# Altium schematic sheet all_Masterboard_EE.SchDoc
size D
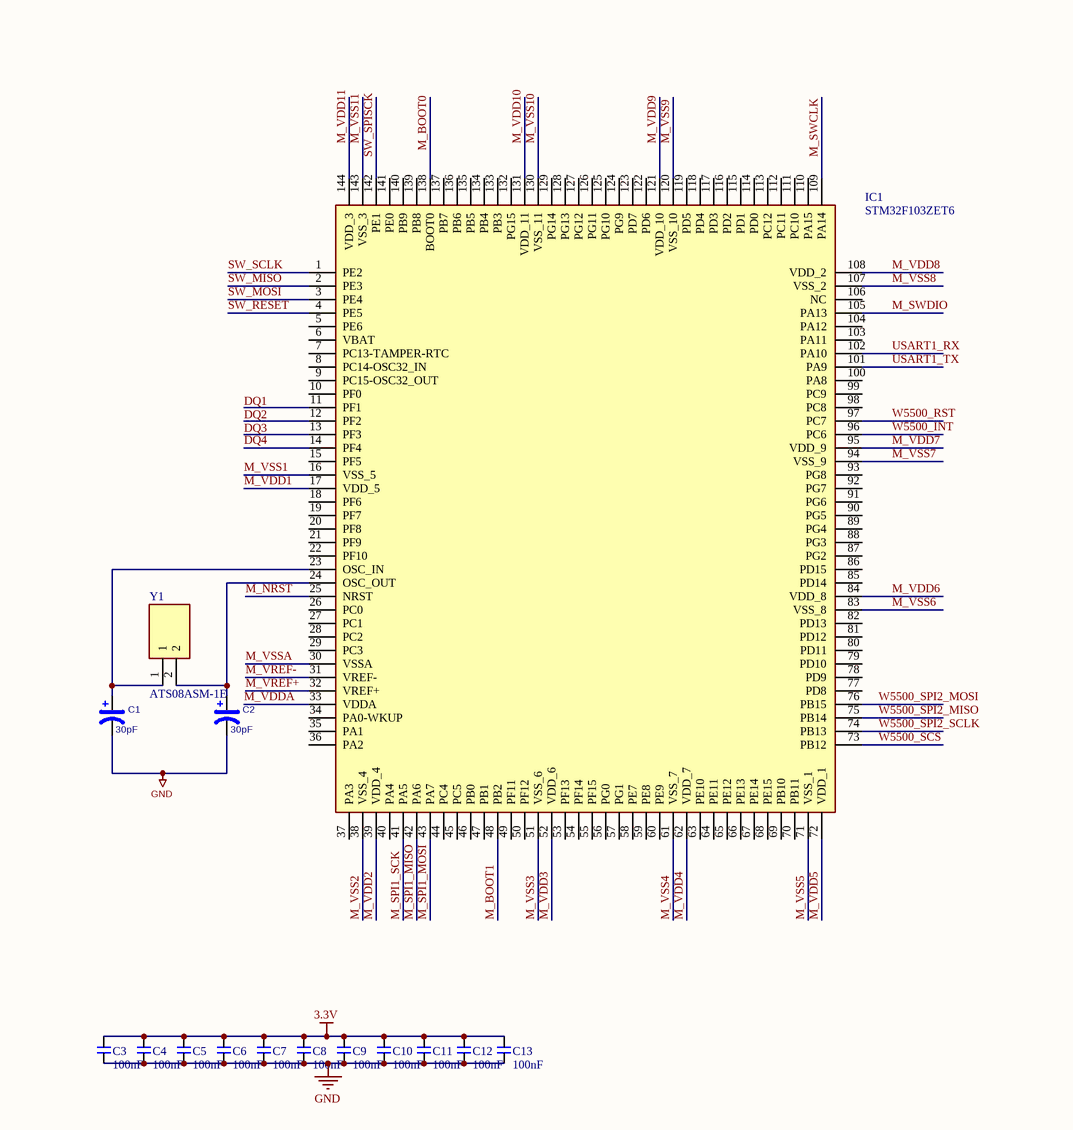
[diagram p0: all_Masterboard_EE.SchDoc, top left]
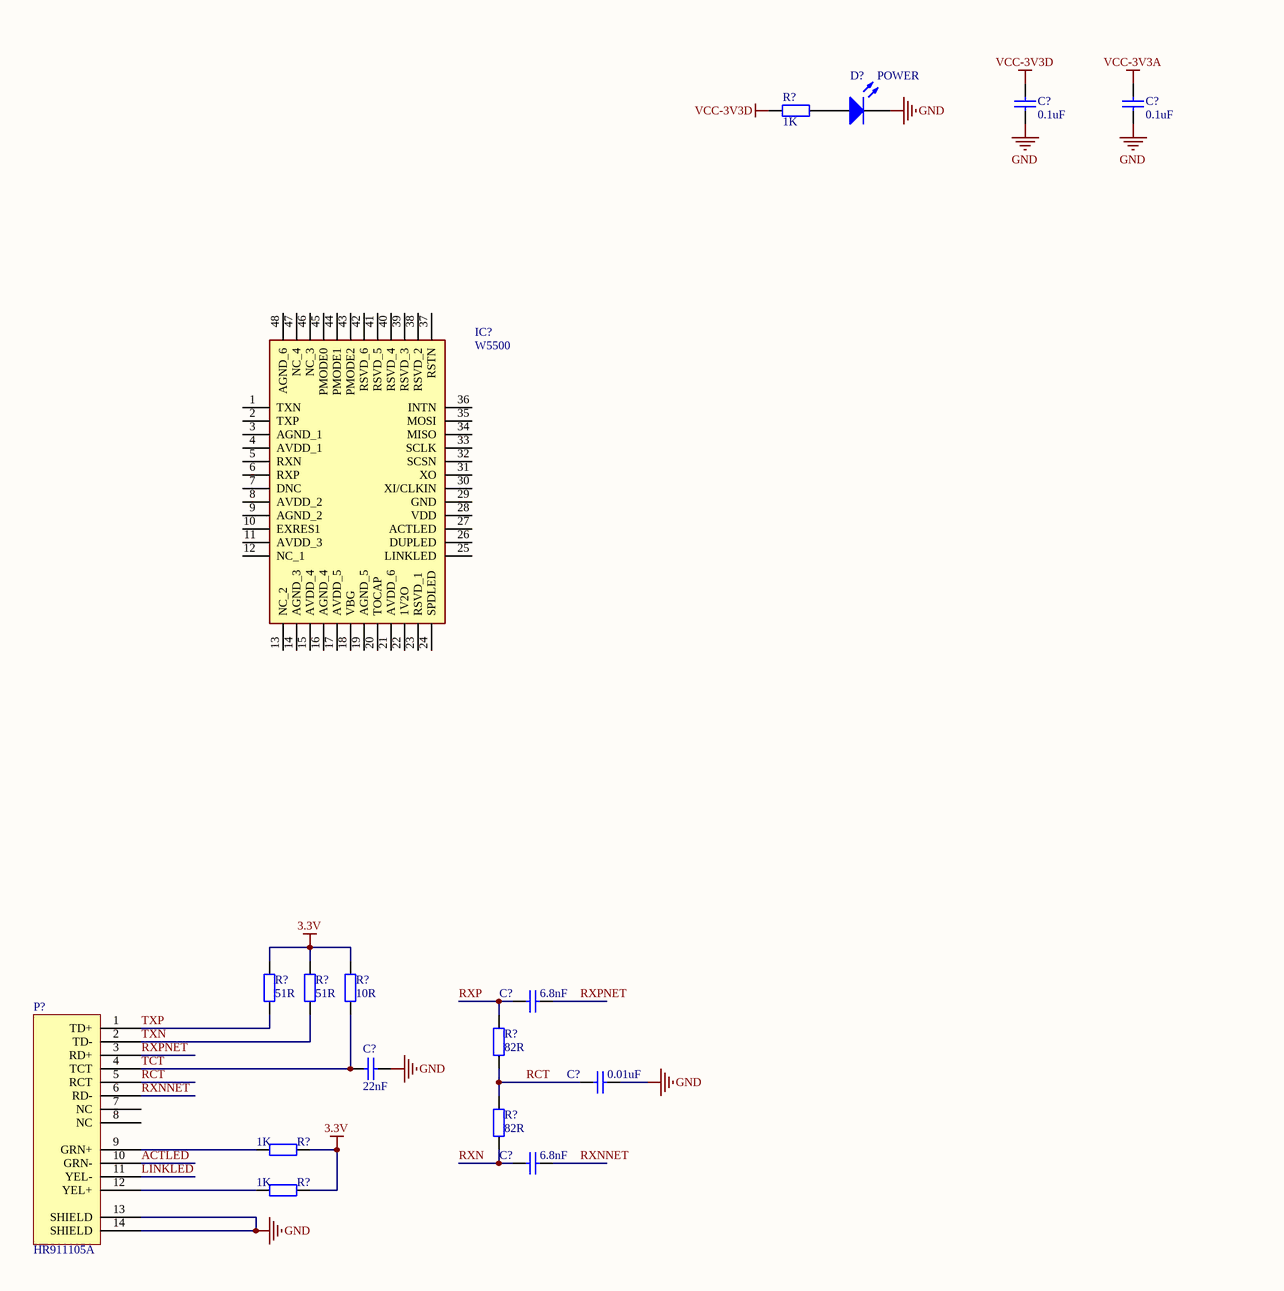
[diagram p1: all_Masterboard_EE.SchDoc, top right]
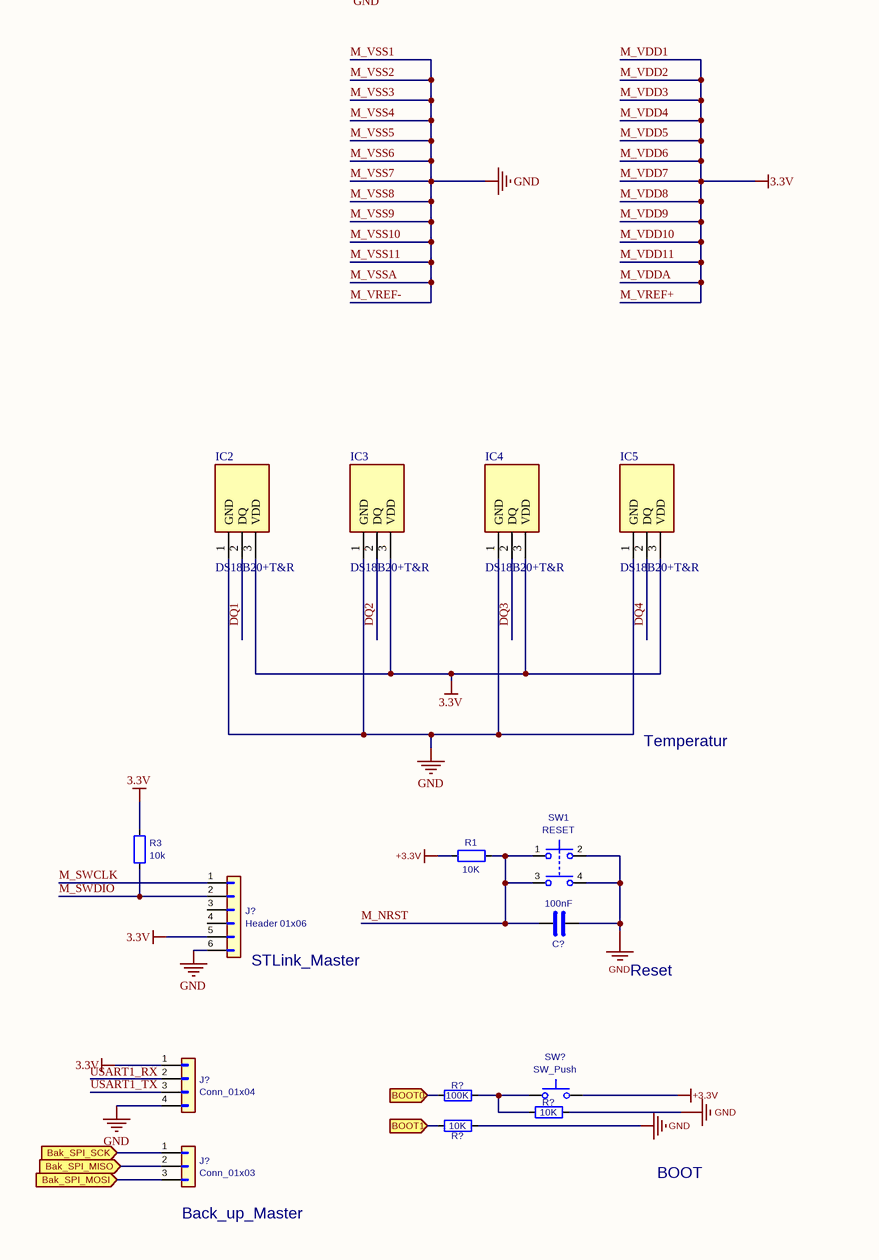
[diagram p2: all_Masterboard_EE.SchDoc, bottom left]
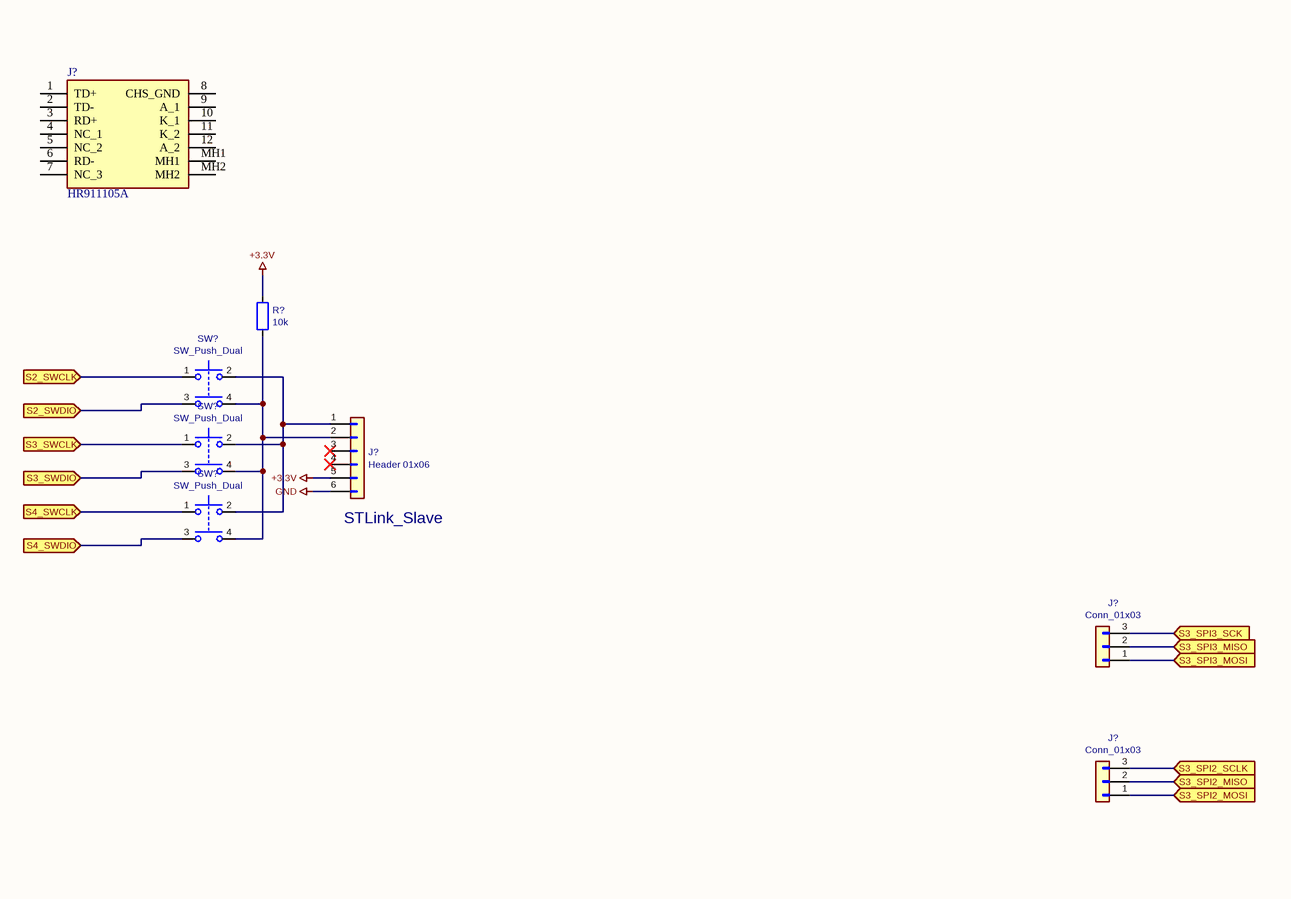
[diagram p3: all_Masterboard_EE.SchDoc, bottom right]

## Parts
(Parts that share a designator on the sheet are numbered #1, #2 ... from top to bottom, then left to right.)
C1  30pF  [0603]
C2  30pF  [0603]
C3  100nF  [0603]
C4  100nF  [0603]
C5  100nF  [0603]
C6  100nF  [0603]
C7  100nF  [0603]
C8  100nF  [0603]
C9  100nF  [0603]
C10  100nF  [0603]
C11  100nF  [0603]
C12  100nF  [0603]
C13  100nF  [0603]
C?#1  value 0.1uF  [C0805]  (hidden comment: Cap)
C?#2  value 0.1uF  [C0805]  (hidden comment: Cap)
C?#3  value 6.8nF  [C0805]  (hidden comment: Cap)
C?#4  value 22nF  [C0805]  (hidden comment: Cap)
C?#5  value 0.01uF  [C0805]  (hidden comment: Cap)
C?#6  value 6.8nF  [C0805]  (hidden comment: Cap)
C?#7  value 100nF  (hidden comment: 104)
D?  POWER  [C0805]
IC1  STM32F103ZET6  [QFP50P2200X2200X160-144N]
IC2  DS18B20+T&R  [DS18B20TR]
IC3  DS18B20+T&R  [DS18B20TR]
IC4  DS18B20+T&R  [DS18B20TR]
IC5  DS18B20+T&R  [DS18B20TR]
IC?  W5500  [QFP50P900X900X160-48N]
J?#1  HR911105A  [HR911105A]
J?#2  Header 01x06
J?#3  Conn_01x03
J?#4  Conn_01x03
J?#5  Header 01x06
J?#6  Conn_01x04
J?#7  Conn_01x03
P?  HR911105A  [HR911105A]
R1  10K
R3  10k
R?#1  value 1K  [C0805]  (hidden comment: Res2)
R?#2  value 51R  [C0805]  (hidden comment: Res2)
R?#3  value 51R  [C0805]  (hidden comment: Res2)
R?#4  value 10R  [C0805]  (hidden comment: Res2)
R?#5  value 82R  [C0805]  (hidden comment: Res2)
R?#6  value 82R  [C0805]  (hidden comment: Res2)
R?#7  value 1K  [C0805]  (hidden comment: Res2)
R?#8  value 1K  [C0805]  (hidden comment: Res2)
R?#9  10k
R?#10  100K
R?#11  10K
R?#12  10K
SW1  RESET
SW?#1  SW_Push_Dual
SW?#2  SW_Push_Dual
SW?#3  SW_Push_Dual
SW?#4  SW_Push
Y1  ATS08ASM-1E  [ATS040SM1]

## Ports
Bak_SPI_MISO (in), Bak_SPI_MOSI (in), Bak_SPI_SCK (in), BOOT0 (in), BOOT1 (in), S2_SWCLK (in), S2_SWDIO (in), S3_SPI2_MISO (in), S3_SPI2_MOSI (in), S3_SPI2_SCLK (in), S3_SPI3_MISO (in), S3_SPI3_MOSI (in), S3_SPI3_SCK (in), S3_SWCLK (in), S3_SWDIO (in), S4_SWCLK (in), S4_SWDIO (in)

## Nets
+3.3V: J?#2.5(Pin_5) R1.2 R?#9.1 SW?#4.2
M_VDD1: C3.1 C4.1 C5.1 C6.1 C7.1 C8.1 C9.1 C10.1 C11.1 C12.1 C13.1 IC1.17(VDD_5) IC1.32(VREF+) IC1.33(VDDA) IC1.39(VDD_4) IC1.52(VDD_6) IC1.62(VDD_7) IC1.72(VDD_1) IC1.84(VDD_8) IC1.95(VDD_9) IC1.108(VDD_2) IC1.121(VDD_10) IC1.131(VDD_11) IC1.144(VDD_3) IC2.3(VDD) IC3.3(VDD) IC4.3(VDD) IC5.3(VDD) J?#5.5(Pin_5) J?#6.1(Pin_1) R3.1 R?#2.1 R?#3.1 R?#4.1 R?#7.1 R?#8.1  [also labelled 3.3V, M_VDD10, M_VDD11, M_VDD2, M_VDD3, M_VDD4, M_VDD5, M_VDD6, M_VDD7, M_VDD8, M_VDD9, M_VDDA, M_VREF+]
M_VREF-: C1.2 C2.2 C3.2 C4.2 C5.2 C6.2 C7.2 C8.2 C9.2 C10.2 C11.2 C12.2 C13.2 C?#1.2 C?#2.1 C?#4.2 C?#5.1 C?#7.2 D?.2(K) IC1.16(VSS_5) IC1.30(VSSA) IC1.31(VREF-) IC1.38(VSS_4) IC1.51(VSS_6) IC1.61(VSS_7) IC1.71(VSS_1) IC1.83(VSS_8) IC1.94(VSS_9) IC1.107(VSS_2) IC1.120(VSS_10) IC1.130(VSS_11) IC1.143(VSS_3) IC2.1(GND) IC3.1(GND) IC4.1(GND) IC5.1(GND) J?#2.6(Pin_6) J?#5.6(Pin_6) J?#6.4(Pin_4) P?.13(SHIELD) P?.14(SHIELD) R?#11.1 R?#12.2 SW1.2 SW1.4  [also labelled GND, M_VSS1, M_VSS10, M_VSS11, M_VSS2, M_VSS3, M_VSS4, M_VSS5, M_VSS6, M_VSS7, M_VSS8, M_VSS9, M_VSSA]
VCC-3V3A: C?#2.2
VCC-3V3D: C?#1.1 R?#1.2
ACTLED: P?.10(GRN-)
Bak_SPI_MISO: J?#7.2(Pin_2) ; port Bak_SPI_MISO
Bak_SPI_MOSI: J?#7.3(Pin_3) ; port Bak_SPI_MOSI
Bak_SPI_SCK: J?#7.1(Pin_1) ; port Bak_SPI_SCK
BOOT0: R?#10.2 ; port BOOT0
BOOT1: R?#12.1 ; port BOOT1
DQ1: IC2.2(DQ)
DQ2: IC3.2(DQ)
DQ3: IC4.2(DQ)
DQ4: IC1.14(PF4) IC5.2(DQ)
LINKLED: P?.11(YEL-)
M_BOOT0: IC1.138(BOOT0)
M_BOOT1: IC1.48(PB2)
M_NRST: C?#7.1 IC1.25(NRST) R1.1 SW1.1 SW1.3
M_SPI1_MISO: IC1.42(PA6)
M_SPI1_MOSI: IC1.43(PA7)
M_SPI1_SCK: IC1.41(PA5)
M_SWCLK: IC1.109(PA14) J?#5.1(Pin_1)
M_SWDIO: IC1.105(PA13) J?#5.2(Pin_2) R3.2
RCT: C?#5.2 P?.5(RCT) R?#5.1 R?#6.2
RXN: C?#6.2 R?#6.1
RXNNET: C?#6.1 P?.6(RD-)
RXP: C?#3.2 R?#5.2
RXPNET: C?#3.1 P?.3(RD+)
S2_SWCLK: SW?#1.1 ; port S2_SWCLK
S2_SWDIO: SW?#1.3 ; port S2_SWDIO
S3_SPI2_MISO: J?#4.2(Pin_2) ; port S3_SPI2_MISO
S3_SPI2_MOSI: J?#4.1(Pin_1) ; port S3_SPI2_MOSI
S3_SPI2_SCLK: J?#4.3(Pin_3) ; port S3_SPI2_SCLK
S3_SPI3_MISO: J?#3.2(Pin_2) ; port S3_SPI3_MISO
S3_SPI3_MOSI: J?#3.1(Pin_1) ; port S3_SPI3_MOSI
S3_SPI3_SCK: J?#3.3(Pin_3) ; port S3_SPI3_SCK
S3_SWCLK: SW?#2.1 ; port S3_SWCLK
S3_SWDIO: SW?#2.3 ; port S3_SWDIO
S4_SWCLK: SW?#3.1 ; port S4_SWCLK
S4_SWDIO: SW?#3.3 ; port S4_SWDIO
SW_MISO: IC1.2(PE3)
SW_MOSI: IC1.3(PE4)
SW_RESET: IC1.4(PE5)
SW_SCLK: IC1.1(PE2)
SW_SPISCK: IC1.142(PE1)
TCT: C?#4.1 P?.4(TCT) R?#4.2
TXN: P?.2(TD-) R?#3.2
TXP: P?.1(TD+) R?#2.2
USART1_RX: IC1.102(PA10)
USART1_TX: IC1.101(PA9) J?#6.3(Pin_3)
W5500_INT: IC1.96(PC6)
W5500_RST: IC1.97(PC7)
W5500_SCS: IC1.73(PB12)
W5500_SPI2_MISO: IC1.75(PB14)
W5500_SPI2_MOSI: IC1.76(PB15)
W5500_SPI2_SCLK: IC1.74(PB13)
NetC1_1: C1.1 IC1.23(OSC_IN) Y1.1
NetC2_1: C2.1 IC1.24(OSC_OUT) Y1.2
NetD?_1: D?.1(A) R?#1.1
NetJ?#2_1: J?#2.1(Pin_1) SW?#1.2 SW?#2.2 SW?#3.2
NetJ?#2_2: J?#2.2(Pin_2) R?#9.2 SW?#1.4 SW?#2.4 SW?#3.4
NetP?_9: P?.9(GRN+) R?#7.2
NetP?_12: P?.12(YEL+) R?#8.2
NetR?#10_1: R?#10.1 R?#11.2 SW?#4.1

Not connected (* = marked no-connect by the designer): IC1 5(PE6) 6(VBAT) 7(PC13-TAMPER-RTC) 8(PC14-OSC32_IN) 9(PC15-OSC32_OUT) 10(PF0) 11(PF1) 12(PF2) 13(PF3) 15(PF5) 18(PF6) 19(PF7) 20(PF8) 21(PF9) 22(PF10) 26(PC0) 27(PC1) 28(PC2) 29(PC3) 34(PA0-WKUP) 35(PA1) 36(PA2) 37(PA3) 40(PA4) 44(PC4) 45(PC5) 46(PB0) 47(PB1) 49(PF11) 50(PF12) 53(PF13) 54(PF14) 55(PF15) 56(PG0) 57(PG1) 58(PE7) 59(PE8) 60(PE9) 63(PE10) 64(PE11) 65(PE12) 66(PE13) 67(PE14) 68(PE15) 69(PB10) 70(PB11) 77(PD8) 78(PD9) 79(PD10) 80(PD11) 81(PD12) 82(PD13) 85(PD14) 86(PD15) 87(PG2) 88(PG3) 89(PG4) 90(PG5) 91(PG6) 92(PG7) 93(PG8) 98(PC8) 99(PC9) 100(PA8) 103(PA11) 104(PA12) 106(NC) 110(PA15) 111(PC10) 112(PC11) 113(PC12) 114(PD0) 115(PD1) 116(PD2) 117(PD3) 118(PD4) 119(PD5) 122(PD6) 123(PD7) 124(PG9) 125(PG10) 126(PG11) 127(PG12) 128(PG13) 129(PG14) 132(PG15) 133(PB3) 134(PB4) 135(PB5) 136(PB6) 137(PB7) 139(PB8) 140(PB9) 141(PE0); IC? 1(TXN) 2(TXP) 3(AGND_1) 4(AVDD_1) 5(RXN) 6(RXP) 7(DNC) 8(AVDD_2) 9(AGND_2) 10(EXRES1) 11(AVDD_3) 12(NC_1) 13(NC_2) 14(AGND_3) 15(AVDD_4) 16(AGND_4) 17(AVDD_5) 18(VBG) 19(AGND_5) 20(TOCAP) 21(AVDD_6) 22(1V2O) 23(RSVD_1) 24(SPDLED) 25(LINKLED) 26(DUPLED) 27(ACTLED) 28(VDD) 29(GND) 30(XI/CLKIN) 31(XO) 32(SCSN) 33(SCLK) 34(MISO) 35(MOSI) 36(INTN) 37(RSTN) 38(RSVD_2) 39(RSVD_3) 40(RSVD_4) 41(RSVD_5) 42(RSVD_6) 43(PMODE2) 44(PMODE1) 45(PMODE0) 46(NC_3) 47(NC_4) 48(AGND_6); J?#1 1(TD+) 2(TD-) 3(RD+) 4(NC_1) 5(NC_2) 6(RD-) 7(NC_3) 8(CHS_GND) 9(A_1) 10(K_1) 11(K_2) 12(A_2) MH1 MH2; J?#2 3(Pin_3)* 4(Pin_4)*; J?#5 3(Pin_3) 4(Pin_4); J?#6 2(Pin_2); P? 7(NC) 8(NC)

## Notes on the sheet
- (near J?#2) STLink_Slave
- Temperatur
- (near J?#5) STLink_Master
- Reset
- (near J?#7) Back_up_Master
- BOOT
- Labels drawn without touching a wire or pin: DQ1, DQ2, DQ3, USART1_RX

## Library data of the parts
C1 C2 = CP1: Value: 30pF
C3-C13 = Cap_0805
C?#1-C?#6 = Cap: Capacitor; Published: 8-Jun-2000; LatestRevisionDate: 17-Jul-2002; LatestRevisionNote: Re-released for DXP Platform.; PackageReference: RAD-0.3; Publisher: Altium Limited; PackageDescription: Radial Cap, Thru-Hole; 2 Leads; 0.3 in Pin Spacing
C?#7 = C
D? = LED0: Typical INFRARED GaAs LED; Published: 8-Jun-2000; LatestRevisionDate: 08-Jul-2005; LatestRevisionNote: Mech Layer 1 removed.; PackageReference: LED-0; Publisher: Altium Limited; PackageDescription: LED; 2 Leads
IC1 = STM32F103ZET6: Integrated Circuit; Manufacturer_Name: ST Microelectronics; Datasheet Link: https://www.st.com/resource/en/datasheet/stm32f103ze.pdf; Height: 1.6mm; Manufacturer_Part_Number: STM32F103ZET6
IC2-IC5 = DS18B20+T&R: Integrated Circuit; Manufacturer_Name: Maxim Integrated; Datasheet Link: https://componentsearchengine.com/Datasheets/1/DS18B20+T&R.pdf; Height: 10.41mm; Manufacturer_Part_Number: DS18B20+T&R; Mouser Part Number: 700-DS18B20T&R; Mouser Price/Stock: https://www.mouser.co.uk/ProductDetail/Maxim-Integrated/DS18B20%2bTR?qs=7H2Jq%252ByxpJKpIDCbiq4lfg%3D%3D
IC? = W5500: Integrated Circuit; Manufacturer_Name: Wiznet Technology; Datasheet Link: https://www.arrow.com/en/products/w5500/wiznet; Height: 1.6mm; Manufacturer_Part_Number: W5500; Arrow Part Number: W5500; Arrow Price/Stock: https://www.arrow.com/en/products/w5500/wiznet
J?#1 = HR911105A: Connector; Manufacturer_Name: HANRUN(Zhongshan HanRun Elec); Datasheet Link: https://datasheet.lcsc.com/szlcsc/Zhongshan-HanRun-Elec-HR911105A_C12074.pdf; Height: 13.75mm; Manufacturer_Part_Number: HR911105A
J?#2 J?#5 = Conn_01x06: Value: Header 01x06
P? = HR911105A: RJ45插座
R1 R3 R?#9-R?#12 = R
  R1 R?#11 R?#12: Value: 10K
  R3 R?#9: Value: 10k
  R?#10: Value: 100K
R?#1-R?#8 = Res2: Resistor; Published: 8-Jun-2000; LatestRevisionDate: 17-Jul-2002; LatestRevisionNote: Re-released for DXP Platform.; PackageReference: AXIAL-0.4; Publisher: Altium Limited; PackageDescription: Axial Device, Thru-Hole; 2 Leads; 0.4 in Pin Spacing
SW1 = SW_Push_Dual: Value: RESET
Y1 = ATS08ASM-1E: Crystal or Oscillator; Manufacturer_Name: CTS; Datasheet Link: https://www.ctscorp.com/wp-content/uploads/ATS-ATSSM.pdf; Height: 4.3mm; Manufacturer_Part_Number: ATS08ASM-1E; Arrow Part Number: ATS08ASM-1E; Arrow Price/Stock: https://www.arrow.com/en/products/ats08asm-1e/cts; Mouser Part Number: 774-ATS08ASM-1E; Mouser Price/Stock: https://www.mouser.co.uk/ProductDetail/CTS-Electronic-Components/ATS08ASM-1E/?qs=tjlMjqRIEYSoOC%2FyJ4%2Frjw%3D%3D
J?#3 J?#4 J?#7 = Conn_01x03: Value: Conn_01x03
J?#6 = Conn_01x04: Value: Conn_01x04
SW?#1-SW?#3 = SW_Push_Dual: Value: SW_Push_Dual
SW?#4 = SW_Push: Value: SW_Push